# Altium schematic sheet NE555.SchDoc
size A4
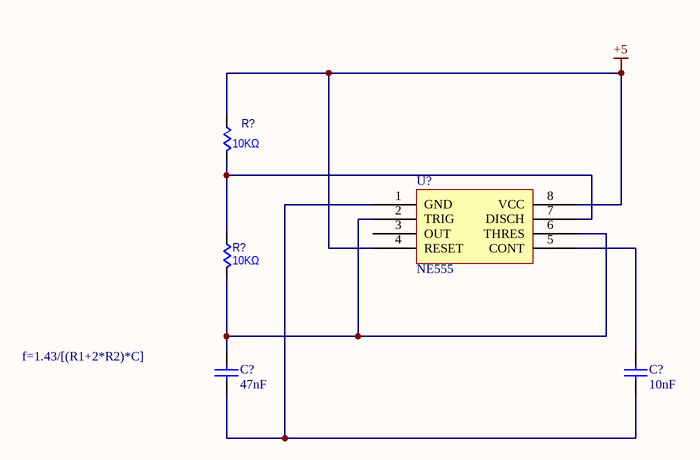
[diagram p0: NE555.SchDoc]

## Parts
(Parts that share a designator on the sheet are numbered #1, #2 ... from top to bottom, then left to right.)
C?#1  value 47nF  [0603]  (hidden comment: Cap)
C?#2  value 10nF  [0603]  (hidden comment: Cap)
R?#1  value 10KΩ  [0805]  (hidden comment: Res)
R?#2  value 10KΩ  [0805]  (hidden comment: Res)
U?  NE555  [SOP-8]

## Nets
+5: R?#1.1 U?.4(RESET) U?.8(VCC)
NetC?#1_1: C?#1.1 C?#2.1 U?.1(GND)
NetC?#1_2: C?#1.2 R?#2.2 U?.2(TRIG) U?.6(THRES)
NetC?#2_2: C?#2.2 U?.5(CONT)
NetR?#1_2: R?#1.2 R?#2.1 U?.7(DISCH)

Not connected (* = marked no-connect by the designer): U? 3(OUT)

## Notes on the sheet
- f=1.43/[(R1+2*R2)*C]

## Library data of the parts
C?#1 C?#2 = Cap: 无极性电容; Published: 8-Jun-2000; LatestRevisionDate: 17-Jul-2002; LatestRevisionNote: Re-released for DXP Platform.; PackageReference: RAD-0.3; Publisher: Altium Limited
R?#1 R?#2 = Res: 常规电阻
U? = NE555: 时基芯片